# Altium schematic sheet CW308T-FE310-G002-CONN.SchDoc: CW308 Connections
size Letter; SheetNumber: 2; SheetTotal: 2; SheetApproved: NO
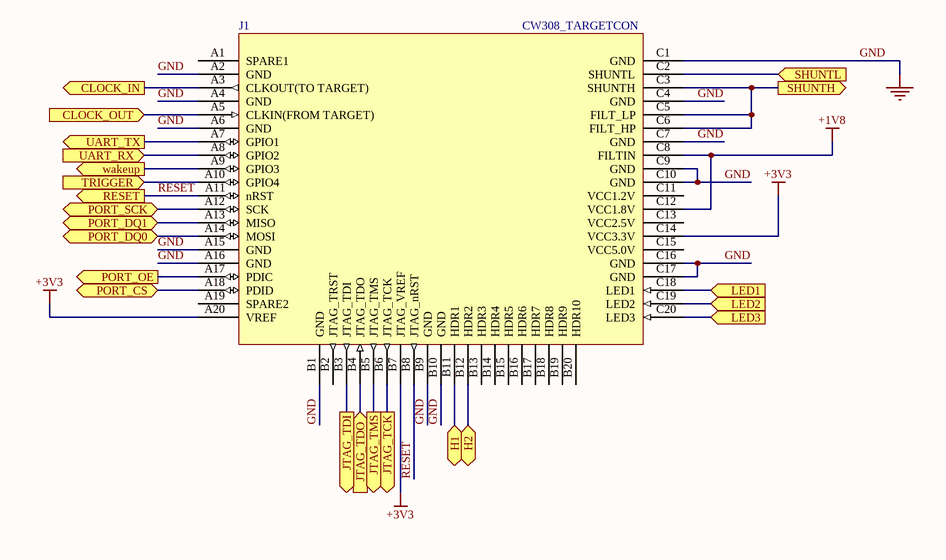
[diagram p0: CW308T-FE310-G002-CONN.SchDoc]

## Parts
J1  CW308_TARGETCON  [CW308_TBOARD_CONN]

## Ports
CLOCK_IN (out), CLOCK_OUT (in), H1 (bidir), H2 (bidir), JTAG_TCK (out), JTAG_TDI (out), JTAG_TDO (in), JTAG_TMS (out), LED1 (in), LED2 (in), LED3 (in), PORT_CS (bidir), PORT_DQ0 (bidir), PORT_DQ1 (bidir), PORT_OE (out), PORT_SCK (bidir), RESET (out), SHUNTH (out), SHUNTL (in), TRIGGER (in), UART_RX (in), UART_TX (out), wakeup (out)

## Nets
+1V8: J1.C8(FILTIN) J1.C12(VCC1.8V)
+3V3: J1.A20(VREF) J1.B7(JTAG_VREF) J1.C14(VCC3.3V)
GND: J1.A2(GND) J1.A4(GND) J1.A6(GND) J1.A15(GND) J1.A16(GND) J1.B1(GND) J1.B9(GND) J1.B10(GND) J1.C1(GND) J1.C4(GND) J1.C7(GND) J1.C9(GND) J1.C10(GND) J1.C16(GND) J1.C17(GND)
CLOCK_IN: J1.A3(CLKOUT(TO_TARGET)) ; port CLOCK_IN
CLOCK_OUT: J1.A5(CLKIN(FROM_TARGET)) ; port CLOCK_OUT
H1: J1.B11(HDR1) ; port H1
H2: J1.B12(HDR2) ; port H2
JTAG_TCK: J1.B6(JTAG_TCK) ; port JTAG_TCK
JTAG_TDI: J1.B3(JTAG_TDI) ; port JTAG_TDI
JTAG_TDO: J1.B4(JTAG_TDO) ; port JTAG_TDO
JTAG_TMS: J1.B5(JTAG_TMS) ; port JTAG_TMS
LED1: J1.C18(LED1) ; port LED1
LED2: J1.C19(LED2) ; port LED2
LED3: J1.C20(LED3) ; port LED3
PORT_CS: J1.A18(PDID) ; port PORT_CS
PORT_DQ0: J1.A14(MOSI) ; port PORT_DQ0
PORT_DQ1: J1.A13(MISO) ; port PORT_DQ1
PORT_OE: J1.A17(PDIC) ; port PORT_OE
PORT_SCK: J1.A12(SCK) ; port PORT_SCK
RESET: J1.A11(nRST) J1.B8(JTAG_nRST) ; port RESET
SHUNTH: J1.C3(SHUNTH) J1.C5(FILT_LP) J1.C6(FILT_HP) ; port SHUNTH
SHUNTL: J1.C2(SHUNTL) ; port SHUNTL
TRIGGER: J1.A10(GPIO4) ; port TRIGGER
UART_RX: J1.A8(GPIO2) ; port UART_RX
UART_TX: J1.A7(GPIO1) ; port UART_TX
wakeup: J1.A9(GPIO3) ; port wakeup

Not connected (* = marked no-connect by the designer): J1 A1(SPARE1) A19(SPARE2) B2(JTAG_TRST) B13(HDR3) B14(HDR4) B15(HDR5) B16(HDR6) B17(HDR7) B18(HDR8) B19(HDR9) B20(HDR10) C11(VCC1.2V) C13(VCC2.5V) C15(VCC5.0V)

## Notes on the sheet
- Title:
- Date:
- Rev:
- Time:
- Project:
- Sheet
- of
- License:
- Copyright © NewAE Technology Inc.
- Approved:
- NewAE.com
- File:

## Library data of the parts
J1 = CW308_TBOARD: CW308 "Standard" Target Board Connector; Component Group: Mechanical; Pitch: 2.54mm; Part Number: CW308_TBOARD; Pin Count: 60; Mounting Technology: Through-hole; Component Kind: Standard; Component Type: Standard